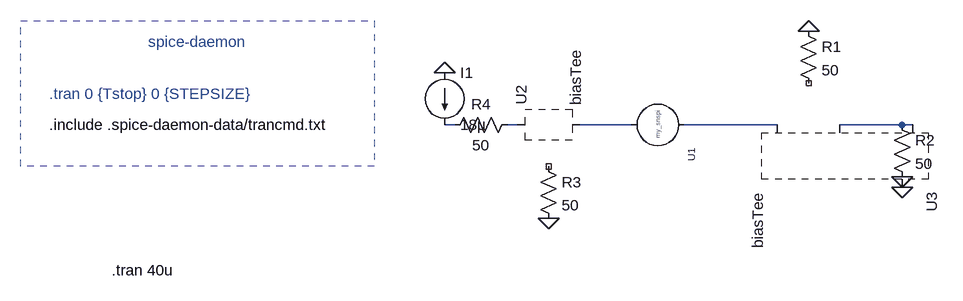
[diagram p0: schematic snspi_test.asc]
snspi_test.asc, the LTspice schematic file:
Version 4
SHEET 1 1604 928
WIRE 864 672 848 672
WIRE 960 672 944 672
WIRE 1136 672 1056 672
WIRE 1360 672 1216 672
WIRE 1552 672 1456 672
WIRE 1568 672 1552 672
FLAG 848 592 0
FLAG 1552 768 0
FLAG 1552 752 0
FLAG 1408 528 0
FLAG 1008 816 0
SYMBOL my_snspi 1216 672 R90
SYMATTR InstName U1
SYMBOL qnn-spice/experimental-setup/biasTee 1008 672 R270
SYMATTR InstName U2
SYMBOL qnn-spice/experimental-setup/biasTee 1408 672 R90
SYMATTR InstName U3
SYMBOL current 848 592 R0
SYMATTR InstName I1
SYMATTR Value 18µ
SYMBOL Res 1392 512 R0
SYMATTR InstName R1
SYMATTR Value 50
SYMBOL Res 1536 656 R0
SYMATTR InstName R2
SYMATTR Value 50
SYMBOL Res 992 720 R0
SYMATTR InstName R3
SYMATTR Value 50
SYMBOL Res 960 656 R90
WINDOW 0 0 56 VBottom 2
WINDOW 3 32 56 VTop 2
SYMATTR InstName R4
SYMATTR Value 50
TEXT 240 672 Left 2 !.include .spice-daemon-data/trancmd.txt
TEXT 392 544 Left 2 ;spice-daemon
TEXT 240 624 Left 2 ;.tran 0 {Tstop} 0 {STEPSIZE}
TEXT 336 896 Left 2 !.tran 40u
RECTANGLE Normal 740 736 196 512 2

The netlist it stands for:
* snspi_test.asc
XU1 N004 N003 my_snspi  ; pins in out
* U2: biasTee (symbol qnn-spice/experimental-setup/biasTee not available, pin order unknown); nets seen at it: N002, N003
* U3: biasTee (symbol qnn-spice/experimental-setup/biasTee not available, pin order unknown); nets seen at it: 0, N004, N005
I1 0 N001 18µ
R1 0 NC_01 50
R2 N005 0 50
R3 NC_02 0 50
R4 N002 N001 50
.include .spice-daemon-data/trancmd.txt
* spice-daemon
* .tran 0 {Tstop} 0 {STEPSIZE}
.tran 40u
.lib /Users/torque/programs/meng-thesis/snspi/.spice-daemon-data/spice-daemon.lib
.backanno
.end